# Altium project Data_Transmission_Panel.PrjPcb
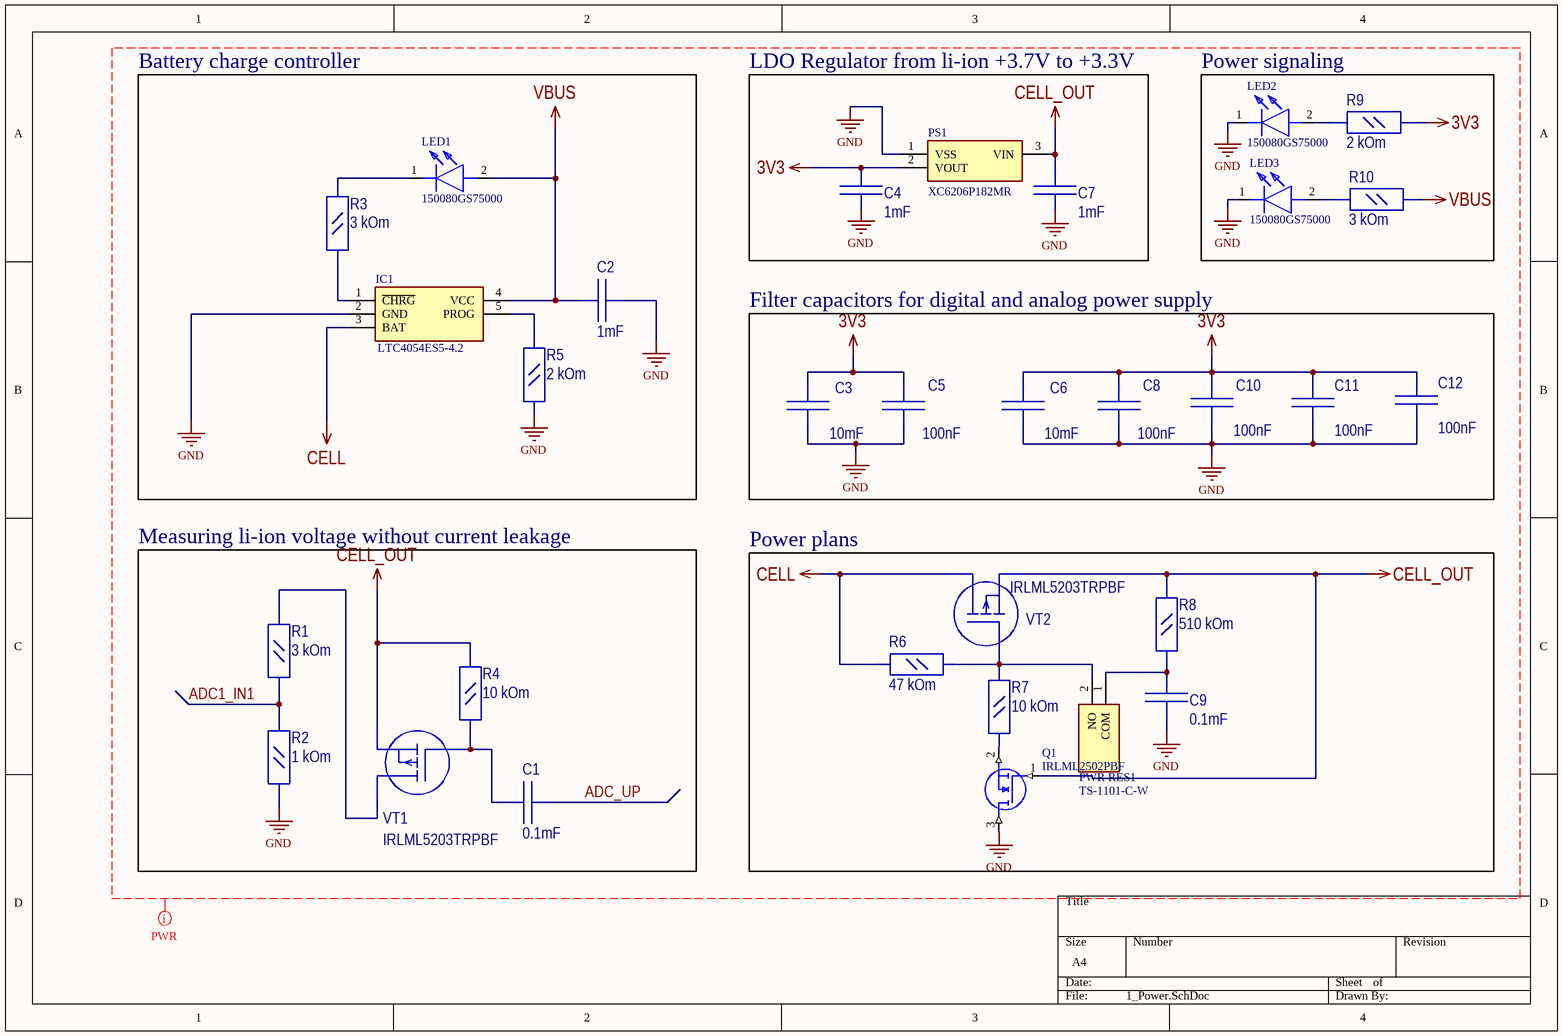
[diagram p0: 1_Power.SchDoc]
4 sheets, 78 parts. Net scope: global (net labels, ports and power ports of the same name join across sheets).
Board file: Panel.PcbDoc
Sheets:
  1_Power.SchDoc
  2_Sensors.SchDoc
  3_Connectors.SchDoc
  5_Keyboard.SchDoc

## Sheet 1_Power.SchDoc
size A4

### Parts
C1  0.1mF  [C_0805]
C2  1mF  [C_0805]
C3  10mF  [C_0805]
C4  1mF  [C_0805]
C5  100nF  [C_0805]
C6  10mF  [C_0805]
C7  1mF  [C_0805]
C8  100nF  [C_0805]
C9  0.1mF  [C_0805]
C10  100nF  [C_0805]
C11  100nF  [C_0805]
C12  100nF  [C_0805]
IC1  LTC4054ES5-4.2  [SOT95P280X100-5N]
LED1  150080GS75000  [LEDM2012X80N]
LED2  150080GS75000  [LEDM2012X80N]
LED3  150080GS75000  [LEDM2012X80N]
PS1  XC6206P182MR  [SOT95P280X130-3N]
PWR_RES1  TS-1101-C-W  [TS1101CW]
Q1  IRLML2502PBF  [SOT95P237X112-3N]
R1  3 kOm  [R_0805]
R2  1 kOm  [R_0805]
R3  3 kOm  [R_0805]
R4  10 kOm  [R_0805]
R5  2 kOm  [R_0805]
R6  47 kOm  [R_0805]
R7  10 kOm  [R_0805]
R8  510 kOm  [R_0805]
R9  2 kOm  [R_0805]
R10  3 kOm  [R_0805]
VT1  IRLML5203TRPBF  [SOT23]
VT2  IRLML5203TRPBF  [SOT23]

### Blocks framed on the sheet
Battery charge controller: C2 IC1 LED1 R3 R5
LDO Regulator from li-ion +3.7V to +3.3V: C4 C7 PS1
Power signaling: LED2 LED3 R9 R10
Filter capacitors for digital and analog power supply: C3 C5 C6 C8 C10-C12
Measuring li-ion voltage without current leakage: C1 R1 R2 R4 VT1
Power plans: C9 PWR_RES1 Q1 R6-R8 VT2

### Nets
3V3: C3.2 C4.2 C5.2 C6.2 C8.2 C10.2 C11.2 C12.2 PS1.2(VOUT) R9.1
CELL: IC1.3(BAT) R6.2 VT2.3(D)
CELL_OUT: C7.2 PS1.3(VIN) Q1.1(G) R4.2 R8.2 VT1.2(S) VT2.2(S)
GND: C2.2 C3.1 C4.1 C5.1 C6.1 C7.1 C8.1 C9.1 C10.1 C11.1 C12.1 IC1.2(GND) LED2.1(K) LED3.1(K) PS1.1(VSS) Q1.3(D) R2.1 R5.1
VBUS: C2.1 IC1.4(VCC) LED1.2(A) R10.1
ADC1_IN1: R1.1 R2.2
ADC_UP: C1.1
NetC1_2: C1.2 R4.1 VT1.1(G)
NetC9_2: C9.2 PWR_RES1.1(COM) R8.1
NetIC1_1: IC1.1(~{CHRG}) R3.1
NetIC1_5: IC1.5(PROG) R5.2
NetLED1_1: LED1.1(K) R3.2
NetLED2_2: LED2.2(A) R9.2
NetLED3_2: LED3.2(A) R10.2
NetPWR_RES1_2: PWR_RES1.2(NO) R6.1 R7.2 VT2.1(G)
NetQ1_2: Q1.2(S) R7.1
NetR1_2: R1.2 VT1.3(D)

### Layout directives
net class PWR: 3V3, ADC1_IN1, ADC_UP, CELL, CELL_OUT, GND, VBUS

### Library data of the parts
C1-C12 = C_0805
  C1 C9: Value: 0.1mF
  C2 C4 C7: Value: 1mF
  C3 C6: Value: 10mF
  C5 C8 C10-C12: Value: 100nF
IC1 = LTC4054ES5-4.2: Integrated Circuit; Manufacturer_Name: Linear Technology; Datasheet Link: https://componentsearchengine.com/Datasheets/1/LTC4054ES5-4.2.pdf; Height: 1mm; Manufacturer_Part_Number: LTC4054ES5-4.2; Mouser Part Number: 584-LTC4054ES5-4.2; Mouser Price/Stock: https://www.mouser.com/Search/Refine.aspx?Keyword=584-LTC4054ES5-4.2
LED1-LED3 = 150080GS75000: LED; Manufacturer_Name: Wurth Elektronik; Datasheet Link: https://katalog.we-online.com/led/datasheet/150080GS75000.pdf; Height: 0.8mm; Manufacturer_Part_Number: 150080GS75000; Mouser Part Number: 710-150080GS75000; Mouser Price/Stock: https://www.mouser.co.uk/ProductDetail/Wurth-Elektronik/150080GS75000?qs=2kOmHSv6VfQRoTEZVk1mGA%3D%3D
PS1 = XC6206P182MR: Power Supply; Manufacturer_Name: Torex; Datasheet Link: https://componentsearchengine.com/Datasheets/2/XC6206P182MR.pdf; Height: 1.3mm; Manufacturer_Part_Number: XC6206P182MR
PWR_RES1 = TS-1101-C-W: Switch; Manufacturer_Name: XKB Connectivity; Datasheet Link: http://www.helloxkb.com/public/images/pdf/TS-1101-C-W-.pdf; Height: 2.6mm; Manufacturer_Part_Number: TS-1101-C-W
Q1 = IRLML2502PBF: MOSFET (N-Channel); Manufacturer_Name: Infineon; Datasheet Link: http://uk.rs-online.com/web/p/products/6106693P; Height: 1.12mm; Manufacturer_Part_Number: IRLML2502PBF; Mouser Part Number: N/A; Mouser Price/Stock: https://www.mouser.co.uk/ProductDetail/Infineon-IR/IRLML2502PbF?qs=Gkr2N%2F2q3o3JwnRSijdL%2Fw%3D%3D
R1 = R_0805: Value: 10 kOm
R2-R9 = R_0805
  R2: Value: 1 kOm
  R3: Value: 3 kOm
  R4 R7: Value: 10 kOm
  R5 R9: Value: 2 kOm
  R6: Value: 47 kOm
  R8: Value: 510 kOm
R10 = R_0805: Value: 2 kOm
VT1 VT2 = IRLML5203TRPBF: Транзистор, P-канал 30В 3A logic

## Sheet 2_Sensors.SchDoc
size A4
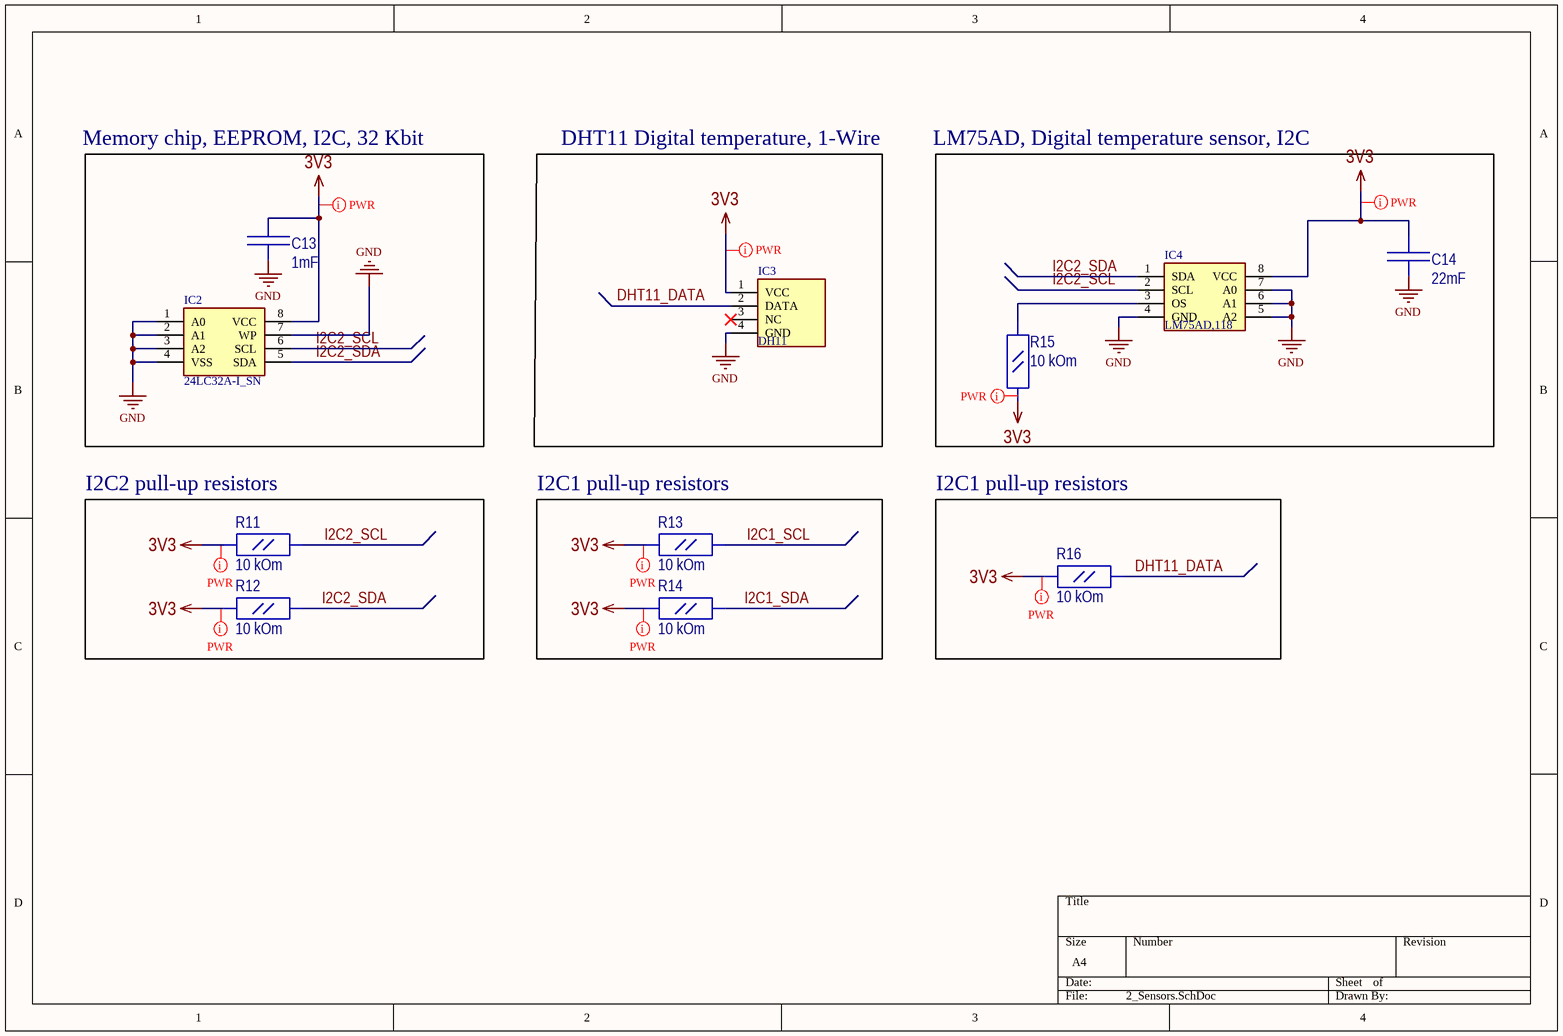
[diagram p1: 2_Sensors.SchDoc]

### Parts
C13  1mF  [C_0805]
C14  22mF  [C_0805]
IC2  24LC32A-I_SN  [SOIC127P600X175-8N]
IC3  DH11  [HDRV4W80P0X254_1X4_1200X500X1550P]
IC4  LM75AD,118  [SOIC127P600X175-8N]
R11  10 kOm  [R_0805]
R12  10 kOm  [R_0805]
R13  10 kOm  [R_0805]
R14  10 kOm  [R_0805]
R15  10 kOm  [R_0805]
R16  10 kOm  [R_0805]

### Blocks framed on the sheet
Memory chip, EEPROM, I2C, 32 Kbit: C13 IC2
DHT11 Digital temperature, 1-Wire: IC3
LM75AD, Digital temperature sensor, I2C: C14 IC4 R15
I2C2 pull-up resistors: R11 R12
I2C1 pull-up resistors: R13 R14
I2C1 pull-up resistors: R16

### Nets
3V3: C13.2 C14.2 IC2.8(VCC) IC3.1(VCC) IC4.8(VCC) R11.1 R12.1 R13.1 R14.1 R15.1 R16.1
GND: C13.1 C14.1 IC2.1(A0) IC2.2(A1) IC2.3(A2) IC2.4(VSS) IC2.7(WP) IC3.4(GND) IC4.4(GND) IC4.5(A2) IC4.6(A1) IC4.7(A0)
DHT11_DATA: IC3.2(DATA) R16.2
I2C1_SCL: R13.2
I2C1_SDA: R14.2
I2C2_SCL: IC2.6(SCL) IC4.2(SCL) R11.2
I2C2_SDA: IC2.5(SDA) IC4.1(SDA) R12.2
NetIC4_3: IC4.3(OS) R15.2

Not connected (* = marked no-connect by the designer): IC3 3(NC)*

### Layout directives
net class PWR: 3V3, (no net found under the mark)

### Library data of the parts
C13 C14 = C_0805
  C13: Value: 1mF
  C14: Value: 22mF
IC2 = 24LC32A-I_SN: Integrated Circuit; Manufacturer_Name: Microchip; Manufacturer_Part_Number: 24LC32A-I/SN; Datasheet Link: http://ww1.microchip.com/downloads/en/DeviceDoc/21713M.pdf; Height: 1.75mm; Mouser Part Number: 579-24LC32A-I/SN; Mouser Price/Stock: https://www.mouser.co.uk/ProductDetail/Microchip-Technology/24LC32A-I-SN?qs=KwArPi4cUogiVlLk9E3nOw%3D%3D; Arrow Part Number: 24LC32A-I/SN; Arrow Price/Stock: https://www.arrow.com/en/products/24lc32a-isn/microchip-technology
IC3 = 101020011: Integrated Circuit; Manufacturer_Name: Seeed Studio; Datasheet Link: https://componentsearchengine.com/Datasheets/1/101020011.pdf; Height: 15.5mm; Manufacturer_Part_Number: 101020011; Mouser Part Number: 713-101020011; Mouser Price/Stock: https://www.mouser.co.uk/ProductDetail/Seeed-Studio/101020011?qs=1%252B9yuXKSi8Dq%252B99bte6U5Q%3D%3D; Arrow Part Number: 101020011; Arrow Price/Stock: https://www.arrow.com/en/products/101020011/seeed-technology-limited
IC4 = LM75AD,118: Integrated Circuit; Manufacturer_Name: NXP; Datasheet Link: http://www.nxp.com/docs/en/data-sheet/LM75A.pdf; Height: 1.75mm; Manufacturer_Part_Number: LM75AD,118; Mouser Part Number: 771-LM75AD-T; Mouser Price/Stock: https://www.mouser.co.uk/ProductDetail/NXP-Semiconductors/LM75AD118?qs=LOCUfHb8d9tvtApDiOTqqg%3D%3D; Arrow Part Number: LM75AD,118; Arrow Price/Stock: https://www.arrow.com/en/products/lm75ad118/nxp-semiconductors?region=nac
R11-R16 = R_0805: Value: 10 kOm

## Sheet 3_Connectors.SchDoc
size A4
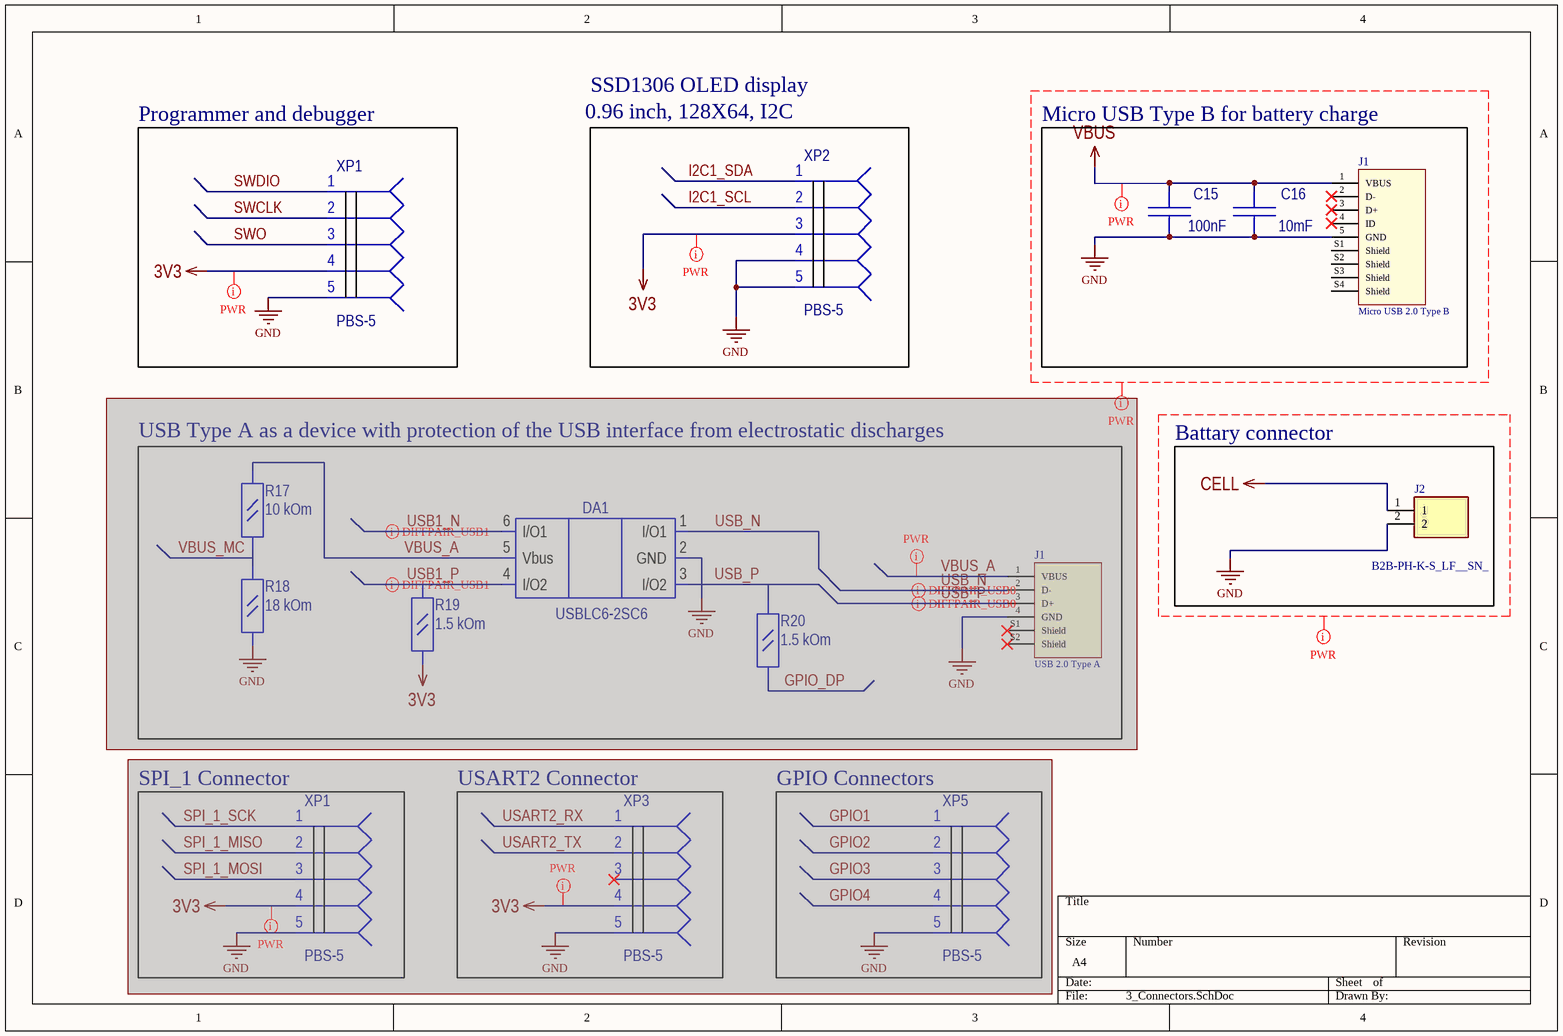
[diagram p2: 3_Connectors.SchDoc]

### Parts
(Parts that share a designator on the sheet are numbered #1, #2 ... from top to bottom, then left to right.)
C15  100nF  [C_0805]
C16  10mF  [C_0805]
DA1  USBLC6-2SC6  [SOT-23-6]  (masked out: inside a compile mask, not in the netlist)
J1#1  Micro USB 2.0 Type B  [629105136821]
J1#2  USB 2.0 Type A  [61400416021]  (masked out: inside a compile mask, not in the netlist)
J2  B2B-PH-K-S_LF__SN_  [SHDR2W50P0X200_1X2_590X450X600P]
R17  10 kOm  [R_0805]  (masked out: inside a compile mask, not in the netlist)
R18  18 kOm  [R_0805]  (masked out: inside a compile mask, not in the netlist)
R19  1.5 kOm  [R_0805]  (masked out: inside a compile mask, not in the netlist)
R20  1.5 kOm  [R_0805]  (masked out: inside a compile mask, not in the netlist)
XP1#1  PBS-5  [PBS-5]
XP1#2  PBS-5  [PBS-5]  (masked out: inside a compile mask, not in the netlist)
XP2  PBS-5  [PBS-5]
XP3  PBS-5  [PBS-5]  (masked out: inside a compile mask, not in the netlist)
XP5  PBS-5  [PBS-5]  (masked out: inside a compile mask, not in the netlist)

### Blocks framed on the sheet
Programmer and debugger: XP1#1
Micro USB Type B for battery charge: C15 C16 J1#1
Battary connector: J2
SPI_1 Connector: XP1#2
USART2 Connector: XP3
GPIO Connectors: XP5

### Nets
3V3: XP1#1.4 XP2.3
CELL: J2.1
GND: C15.1 C16.1 J1#1.5(GND) J2.2 XP1#1.5 XP2.4 XP2.5
VBUS: C15.2 C16.2 J1#1.1(VBUS)
I2C1_SCL: XP2.2
I2C1_SDA: XP2.1
SWCLK: XP1#1.2
SWDIO: XP1#1.1
SWO: XP1#1.3

Not connected (* = marked no-connect by the designer): J1#1 2(D-)* 3(D+)* 4(ID)* S1(Shield) S2(Shield) S3(Shield) S4(Shield)

### Layout directives
differential pair; differential pair class USB1: (no net found under the mark)
differential pair; differential pair class USB0: (no net found under the mark)
net class PWR: 3V3, (no net found under the mark), CELL, GND, VBUS

### Notes on the sheet
- SSD1306 OLED display
- 0.96 inch, 128X64, I2C
- (near R17) USB Type A as a device with protection of the USB interface from electrostatic discharges

### Library data of the parts
C15 C16 = C_0805
  C15: Value: 100nF
  C16: Value: 10mF
J1#1 = 629105136821: Micro USB 2.0 Type B Horizontal SMT 5 Contacts WR-COM; Rated Current: 1 A; Gender: Female; ComponentLink1Description: Manufacturer; ComponentLink1URL: http://www.we-online.de; ComponentLink2Description: Datasheet; ComponentLink2URL: http://katalog.we-online.de/em/datasheet/629105136821.pdf; Part Number: 629105136821; Published Date: May 2018; Publisher: Wurth Elektronik; Orientation: Horizontal; Interface Type: Micro USB 2.0 Type B; Operating Temperature: -40 to 85 degC; Mounting Technology: SMT; Packaging: Tape and Reel
J1#2 = 61400416021: USB 2.0 Type A Horizontal THT WR-COM; Rated Current: 1.5 A; Gender: Female; ComponentLink1Description: Manufacturer; ComponentLink1URL: http://www.we-online.de; ComponentLink2Description: Datasheet; ComponentLink2URL: http://katalog.we-online.de/em/datasheet/61400416021.pdf; Part Number: 61400416021; Published Date: May 2018; Publisher: Wurth Elektronik; Orientation: Horizontal; Interface Type: USB 2.0 Type A; Operating Temperature: -40 to 105 degC; Mounting Technology: THT; Packaging: Tray
J2 = B2B-PH-K-S_LF__SN_: Connector; Manufacturer_Name: JST (JAPAN SOLDERLESS TERMINALS); Manufacturer_Part_Number: B2B-PH-K-S(LF)(SN); Datasheet Link: https://datasheet.lcsc.com/szlcsc/JST-Sales-America-B2B-PH-K-S-LF-SN_C131337.pdf; Height: 6mm; Arrow Part Number: B2B-PH-K-S(LF)(SN); Arrow Price/Stock: https://www.arrow.com/en/products/b2b-ph-k-s-lf-sn/jst-manufacturing
R17 = R_0805: Value: 10 кOm
R18-R20 = R_0805
  R18: Value: 18 kOm
  R19 R20: Value: 1.5 kOm
DA1 = USBLC6-2SC6: HelpURL: https://static.chipdip.ru/lib/093/DOC001093117.pdf

## Sheet 5_Keyboard.SchDoc
size A4
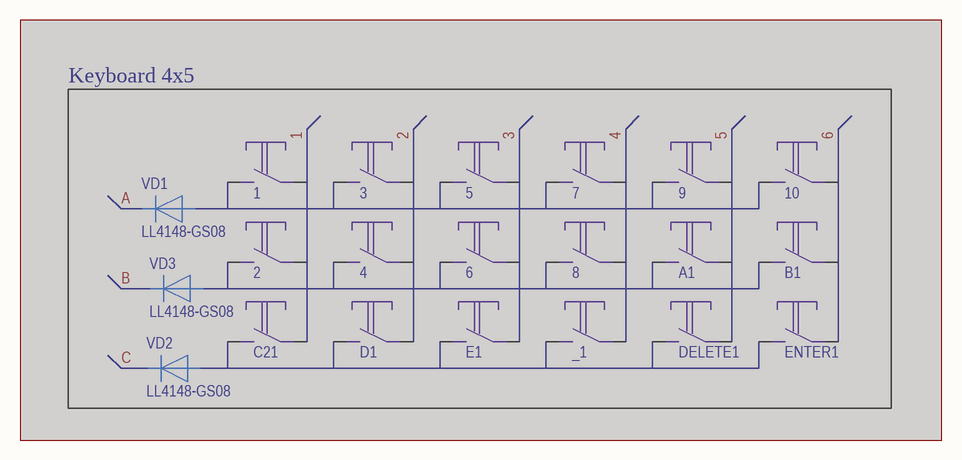
[diagram p3: 5_Keyboard.SchDoc]

### Parts
1  KLS7-TS6601  [KLS7-TS6601]  (value not drawn)  (masked out: inside a compile mask, not in the netlist)
2  KLS7-TS6601  [KLS7-TS6601]  (value not drawn)  (masked out: inside a compile mask, not in the netlist)
3  KLS7-TS6601  [KLS7-TS6601]  (value not drawn)  (masked out: inside a compile mask, not in the netlist)
4  KLS7-TS6601  [KLS7-TS6601]  (value not drawn)  (masked out: inside a compile mask, not in the netlist)
5  KLS7-TS6601  [KLS7-TS6601]  (value not drawn)  (masked out: inside a compile mask, not in the netlist)
6  KLS7-TS6601  [KLS7-TS6601]  (value not drawn)  (masked out: inside a compile mask, not in the netlist)
7  KLS7-TS6601  [KLS7-TS6601]  (value not drawn)  (masked out: inside a compile mask, not in the netlist)
8  KLS7-TS6601  [KLS7-TS6601]  (value not drawn)  (masked out: inside a compile mask, not in the netlist)
9  KLS7-TS6601  [KLS7-TS6601]  (value not drawn)  (masked out: inside a compile mask, not in the netlist)
10  KLS7-TS6601  [KLS7-TS6601]  (value not drawn)  (masked out: inside a compile mask, not in the netlist)
_1  KLS7-TS6601  [KLS7-TS6601]  (value not drawn)  (masked out: inside a compile mask, not in the netlist)
A1  KLS7-TS6601  [KLS7-TS6601]  (value not drawn)  (masked out: inside a compile mask, not in the netlist)
B1  KLS7-TS6601  [KLS7-TS6601]  (value not drawn)  (masked out: inside a compile mask, not in the netlist)
C21  KLS7-TS6601  [KLS7-TS6601]  (value not drawn)  (masked out: inside a compile mask, not in the netlist)
D1  KLS7-TS6601  [KLS7-TS6601]  (value not drawn)  (masked out: inside a compile mask, not in the netlist)
DELETE1  KLS7-TS6601  [KLS7-TS6601]  (value not drawn)  (masked out: inside a compile mask, not in the netlist)
E1  KLS7-TS6601  [KLS7-TS6601]  (value not drawn)  (masked out: inside a compile mask, not in the netlist)
ENTER1  KLS7-TS6601  [KLS7-TS6601]  (value not drawn)  (masked out: inside a compile mask, not in the netlist)
VD1  LL4148-GS08  [SOD-80]  (masked out: inside a compile mask, not in the netlist)
VD2  LL4148-GS08  [SOD-80]  (masked out: inside a compile mask, not in the netlist)
VD3  LL4148-GS08  [SOD-80]  (masked out: inside a compile mask, not in the netlist)

### Blocks framed on the sheet
Keyboard 4x5: 1-10 _1 A1 B1 C21 D1 DELETE1 E1 ENTER1 VD1-VD3

### Library data of the parts
VD1-VD3 = LL4148-GS08: Диод

## Nets that join several sheets
3V3: 1_Power (10 pins), 2_Sensors (11 pins), 3_Connectors (XP1#1.4 XP2.3)
CELL: 1_Power (IC1.3 R6.2 VT2.3), 3_Connectors (J2.1)
GND: 1_Power (18 pins), 2_Sensors (12 pins), 3_Connectors (7 pins)
VBUS: 1_Power (C2.1 IC1.4 LED1.2 R10.1), 3_Connectors (C15.2 C16.2 J1#1.1)
I2C1_SCL: 2_Sensors (R13.2), 3_Connectors (XP2.2)
I2C1_SDA: 2_Sensors (R14.2), 3_Connectors (XP2.1)